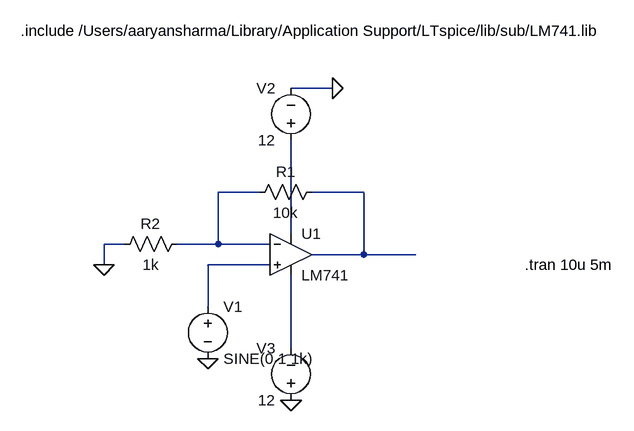
[diagram p0: schematic nonInvertingStage.asc]
nonInvertingStage.asc, the LTspice schematic file:
Version 4
SHEET 1 936 680
WIRE 496 48 432 48
WIRE 384 208 320 208
WIRE 544 208 464 208
WIRE 432 272 432 128
WIRE 176 288 144 288
WIRE 320 288 320 208
WIRE 320 288 256 288
WIRE 400 288 320 288
WIRE 544 304 544 208
WIRE 544 304 464 304
WIRE 624 304 544 304
WIRE 144 320 144 288
WIRE 400 320 304 320
WIRE 304 384 304 320
WIRE 432 448 432 336
FLAG 144 320 0
FLAG 304 464 0
FLAG 432 528 0
FLAG 496 48 0
SYMBOL OpAmps/opamp2 432 240 R0
SYMATTR InstName U1
SYMATTR Value LM741
SYMBOL res 480 192 R90
WINDOW 0 0 56 VBottom 2
WINDOW 3 32 56 VTop 2
SYMATTR InstName R1
SYMATTR Value 10k
SYMBOL res 272 272 R90
WINDOW 0 0 56 VBottom 2
WINDOW 3 32 56 VTop 2
SYMATTR InstName R2
SYMATTR Value 1k
SYMBOL voltage 304 368 R0
SYMATTR InstName V1
SYMATTR Value SINE(0 1 1k)
SYMBOL voltage 432 144 R180
WINDOW 0 24 96 Left 2
WINDOW 3 24 16 Left 2
SYMATTR InstName V2
SYMATTR Value 12
SYMBOL voltage 432 544 R180
WINDOW 0 24 96 Left 2
WINDOW 3 24 16 Left 2
SYMATTR InstName V3
SYMATTR Value 12
TEXT 792 320 Left 2 !.tran 10u 5m
TEXT 16 -40 Left 2 !.include /Users/aaryansharma/Library/Application Support/LTspice/lib/sub/LM741.lib

The netlist it stands for:
* nonInvertingStage.asc
XU1 N004 N001 N003 N005 N002 LM741  ; pins In+ In- V+ V- OUT
R1 N002 N001 10k
R2 N001 0 1k
V1 N004 0 SINE(0 1 1k)
V2 N003 0 12
V3 0 N005 12
.tran 10u 5m
.include /Users/aaryansharma/Library/Application Support/LTspice/lib/sub/LM741.lib
.backanno
.end